# Altium schematic sheet 0_BlkDiag.SchDoc: Block Diagram
size A3; SheetNumber: 0
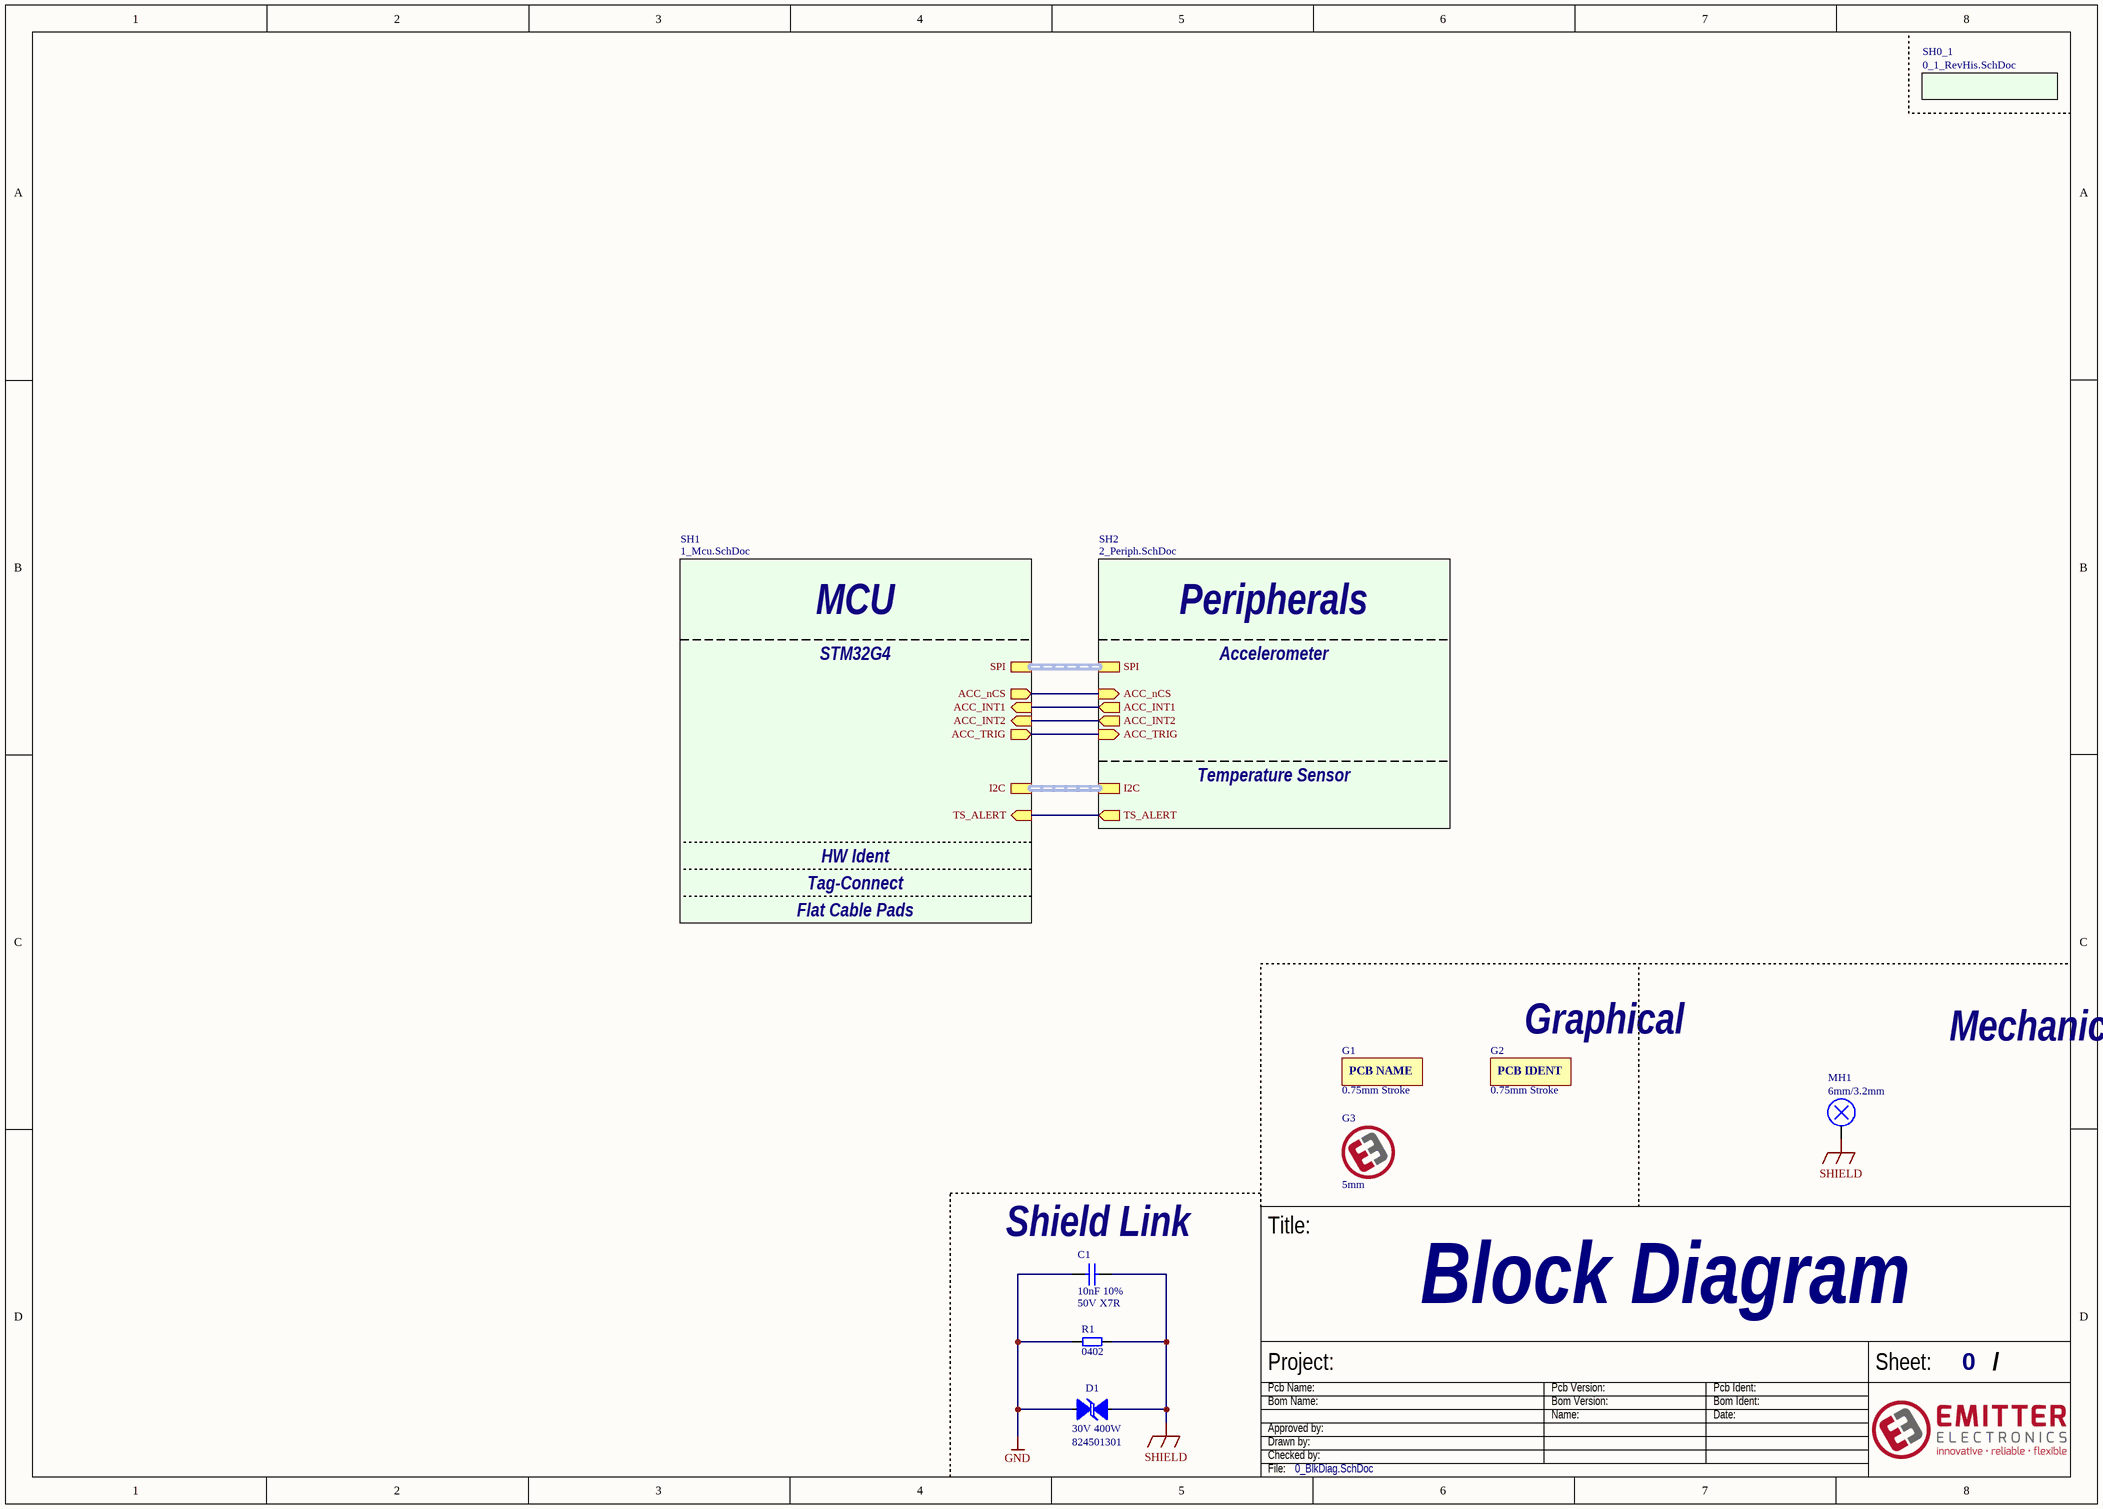
[diagram p0: 0_BlkDiag.SchDoc]

## Parts
C1  Param 1: 10nF 10%  Param 2: 50V X7R  [CAP_0402_L]  (hidden comment: CC0402KRX7R9BB103)
D1  Param 1: 30V 400W  [DIONM510X270_SMA_DO-214AC_L]  (hidden comment: 824501301)
G1  Param 1: 0.75mm Stroke  [GRAPH_PCB_NAME_0.75MM_STROKE]  (hidden comment: /)  (no BOM)
G2  Param 1: 0.75mm Stroke  [GRAPH_PCB_IDENT_0.75MM_STROKE]  (hidden comment: /)  (no BOM)
G3  Param 1: 5mm  [GRAPH_EMITTER_5MM]  (hidden comment: /)  (no BOM)
MH1  Param 1: 6mm/3.2mm  [PS-MH_C600H320]  (hidden comment: /)  (no BOM)
R1  Param 1: 0402  [RES_0402_L]  (hidden comment: RES 0402)

## Sub-sheets
SH0_1 = 0_1_RevHis.SchDoc: no entries
SH1 = 1_Mcu.SchDoc: TS_ALERT (in), ACC_nCS (out), ACC_INT1 (in), ACC_INT2 (in), ACC_TRIG (out), SPI (harness SPI), I2C (harness I2C)
SH2 = 2_Periph.SchDoc: TS_ALERT (out), ACC_nCS (in), ACC_INT2 (out), ACC_INT1 (out), ACC_TRIG (in), SPI (harness SPI), I2C (harness I2C)

## Nets
GND: C1.1 D1.1 R1.1
SHIELD: C1.2 D1.2 MH1.1 R1.2
(unnamed): sheet SH1/TS_ALERT, sheet SH2/TS_ALERT
(unnamed): sheet SH1/ACC_nCS, sheet SH2/ACC_nCS
(unnamed): sheet SH1/ACC_INT1, sheet SH2/ACC_INT1
(unnamed): sheet SH1/ACC_INT2, sheet SH2/ACC_INT2
(unnamed): sheet SH1/ACC_TRIG, sheet SH2/ACC_TRIG

## Buses and harness runs
harness sheet SH1/I2C = sheet SH2/I2C
harness sheet SH1/SPI = sheet SH2/SPI

## Notes on the sheet
- MCU
- STM32G4
- Peripherals
- Accelerometer
- Temperature Sensor
- HW Ident
- Tag-Connect
- Flat Cable Pads
- Graphical
- Mechanical
- (near C1) Shield Link
- Title:
- Project:
- Pcb Name:
- Pcb Version:
- Pcb Ident:
- Sheet:
- /
- Bom Name:
- Drawn by:
- Checked by:
- Approved by:
- Bom Version:
- Name:
- Bom Ident:
- Date:
- File:
- (in symbol GRAPH_PCB_IDENT_0.75MM_STROKE) PCB IDENT
- (in symbol GRAPH_PCB_NAME_0.75MM_STROKE) PCB NAME

## Library data of the parts
C1 = CAP_0402_10nF_10%_50V_X7R_CC0402KRX7R9BB103: CAP 0402 10nF 10% 50V X7R; Assembly Service Part Choice: Yes; Mfr 1: YAGEO; zAlternative 1 - Mfr 1: AVX; zAlternative 1 - Mfr No 2: /; zAlternative 2 - Mfr 1: KEMET; zAlternative 2 - Mfr No 1: C0402C103K5RACTU; zAlternative 1 - Mfr No 1: 04025C103KAT2A; Placement: SMD; Temp Max: +125°C; Temp Min: -55°C; Assembly Service Provides Material: Yes; Author: GH; Date: 30.10.2020; sDigikey 1: /; sFarnell 1: /; sMouser 1: /; sDigikey 2: /; sFarnell 2: /; sMouser 2: /; Mfr No 1: CC0402KRX7R9BB103; Mfr No 2: /; zAlternative 2 - Mfr No 2: /; zAlternative 3 - Mfr 1: /; zAlternative 3 - Mfr No 1: /; zAlternative 3 - Mfr No 2: /; zAlternative 4 - Mfr 1: /; zAlternative 4 - Mfr No 1: /; zAlternative 4 - Mfr No 2: /; zAlternative 5 - Mfr 1: /; zAlternative 5 - Mfr No 1: /; zAlternative 5 - Mfr No 2: /; zAlternative 6 - Mfr 1: /; zAlternative 6 - Mfr No 1: /; zAlternative 6 - Mfr No 2: /; zAlternative 7 - Mfr 1: /; zAlternative 7 - Mfr No 1: /; zAlternative 7 - Mfr No 2: /; zAlternative 8 - Mfr 1: /; zAlternative 8 - Mfr No 1: /; zAlternative 8 - Mfr No 2: /; zAlternative 9 - Mfr 1: /; zAlternative 9 - Mfr No 1: /; zAlternative 9 - Mfr No 2: /; Auralix WH: /; Mfr 2: /; zAlternative 1 - Mfr 2: /; zAlternative 2 - Mfr 2: /; zAlternative 3 - Mfr 2: /; zAlternative 4 - Mfr 2: /; zAlternative 5 - Mfr 2: /; zAlternative 6 - Mfr 2: /; zAlternative 7 - Mfr 2: /; zAlternative 8 - Mfr 2: /; zAlternative 9 - Mfr 2: /; Mfr 3: /; Mfr No 3: /; sArrow 1: /; sArrow 2: /; sArrow 3: /; sDigikey 3: /; sFarnell 3: /; sMouser 3: /
D1 = D-TVS-B_30V_400W_824501301: 824501301 - TVS Diode, WE-TVSP Series, Bidirectional, 30 V, 48.4 V, DO-214AC, 2 Pins; Assembly Service Part Choice: No; Mfr 1: WURTH ELECTRONICS; Placement: SMD; Assembly Service Provides Material: Yes; Param 2: /; Temp Max: +150°C; Temp Min: -65°C; Author: TV; Date: 7.7.2018; sDigikey 1: Yes; sFarnell 1: Yes; sMouser 1: Yes; sDigikey 2: /; sFarnell 2: /; sMouser 2: /; Mfr No 2: /; zAlternative 1 - Mfr 1: /; zAlternative 1 - Mfr No 2: /; zAlternative 2 - Mfr 1: /; zAlternative 2 - Mfr No 1: /; zAlternative 1 - Mfr No 1: /; zAlternative 2 - Mfr No 2: /; zAlternative 3 - Mfr 1: /; zAlternative 3 - Mfr No 1: /; zAlternative 3 - Mfr No 2: /; zAlternative 4 - Mfr 1: /; zAlternative 4 - Mfr No 1: /; zAlternative 4 - Mfr No 2: /; zAlternative 5 - Mfr 1: /; zAlternative 5 - Mfr No 1: /; zAlternative 5 - Mfr No 2: /; zAlternative 6 - Mfr 1: /; zAlternative 6 - Mfr No 1: /; zAlternative 6 - Mfr No 2: /; zAlternative 7 - Mfr 1: /; zAlternative 7 - Mfr No 1: /; zAlternative 7 - Mfr No 2: /; zAlternative 8 - Mfr 1: /; zAlternative 8 - Mfr No 1: /; zAlternative 8 - Mfr No 2: /; zAlternative 9 - Mfr 1: /; zAlternative 9 - Mfr No 1: /; zAlternative 9 - Mfr No 2: /; Auralix WH: /; Mfr 2: /; zAlternative 1 - Mfr 2: /; zAlternative 2 - Mfr 2: /; zAlternative 3 - Mfr 2: /; zAlternative 4 - Mfr 2: /; zAlternative 5 - Mfr 2: /; zAlternative 6 - Mfr 2: /; zAlternative 7 - Mfr 2: /; zAlternative 8 - Mfr 2: /; zAlternative 9 - Mfr 2: /; Mfr 3: /; Mfr No 3: /; sArrow 1: /; sArrow 2: /; sArrow 3: /; sDigikey 3: /; sFarnell 3: /; sMouser 3: /; Mfr No 1: 824501301
G1 = GRAPH_PCB_NAME_0.75MM_STROKE: Placement: /; Assembly Service Part Choice: /; Temp max: /; Temp min: /; Assembly Service Provides Material: /; Author: TV; Date: 16.4.2019; sFarnell 1: /; sDigikey 1: /; sMouser 1: /; sDigikey 2: /; sFarnell 2: /; sMouser 2: /; Mfr No 1: /; Mfr No 2: /; Param 2: /; zAlternative 1 - Mfr No 2: /; zAlternative 2 - Mfr No 1: /; zAlternative 1 - Mfr No 1: /; zAlternative 2 - Mfr No 2: /; zAlternative 3 - Mfr No 1: /; zAlternative 3 - Mfr No 2: /; zAlternative 4 - Mfr No 1: /; zAlternative 4 - Mfr No 2: /; zAlternative 5 - Mfr No 1: /; zAlternative 5 - Mfr No 2: /; zAlternative 6 - Mfr No 1: /; zAlternative 6 - Mfr No 2: /; zAlternative 7 - Mfr No 1: /; zAlternative 7 - Mfr No 2: /; zAlternative 8 - Mfr No 1: /; zAlternative 8 - Mfr No 2: /; zAlternative 9 - Mfr No 1: /; zAlternative 9 - Mfr No 2: /; Auralix WH: /; Mfr 1: /; Mfr 2: /; Mfr 3: /; Mfr No 3: /; sArrow 1: /; sArrow 2: /; sArrow 3: /; sDigikey 3: /; sFarnell 3: /; sMouser 3: /; zAlternative 1 - Mfr 1: /; zAlternative 1 - Mfr 2: /; zAlternative 2 - Mfr 1: /; zAlternative 2 - Mfr 2: /; zAlternative 3 - Mfr 1: /; zAlternative 3 - Mfr 2: /; zAlternative 4 - Mfr 1: /; zAlternative 4 - Mfr 2: /; zAlternative 5 - Mfr 1: /; zAlternative 5 - Mfr 2: /; zAlternative 6 - Mfr 1: /; zAlternative 6 - Mfr 2: /; zAlternative 7 - Mfr 1: /; zAlternative 7 - Mfr 2: /; zAlternative 8 - Mfr 1: /; zAlternative 8 - Mfr 2: /; zAlternative 9 - Mfr 1: /; zAlternative 9 - Mfr 2: /
G2 = GRAPH_PCB_IDENT_0.75MM_STROKE: Placement: /; Assembly Service Part Choice: /; Temp max: /; Temp min: /; Author: TV; Date: 16.4.2019; Assembly Service Provides Material: /; sFarnell 1: /; sDigikey 1: /; sMouser 1: /; sDigikey 2: /; sFarnell 2: /; sMouser 2: /; Mfr No 1: /; Mfr No 2: /; Param 2: /; zAlternative 1 - Mfr No 2: /; zAlternative 2 - Mfr No 1: /; zAlternative 1 - Mfr No 1: /; zAlternative 2 - Mfr No 2: /; zAlternative 3 - Mfr No 1: /; zAlternative 3 - Mfr No 2: /; zAlternative 4 - Mfr No 1: /; zAlternative 4 - Mfr No 2: /; zAlternative 5 - Mfr No 1: /; zAlternative 5 - Mfr No 2: /; zAlternative 6 - Mfr No 1: /; zAlternative 6 - Mfr No 2: /; zAlternative 7 - Mfr No 1: /; zAlternative 7 - Mfr No 2: /; zAlternative 8 - Mfr No 1: /; zAlternative 8 - Mfr No 2: /; zAlternative 9 - Mfr No 1: /; zAlternative 9 - Mfr No 2: /; Auralix WH: /; Mfr 1: /; Mfr 2: /; Mfr 3: /; Mfr No 3: /; zAlternative 1 - Mfr 1: /; zAlternative 1 - Mfr 2: /; zAlternative 2 - Mfr 1: /; zAlternative 2 - Mfr 2: /; zAlternative 3 - Mfr 1: /; zAlternative 3 - Mfr 2: /; zAlternative 4 - Mfr 1: /; zAlternative 4 - Mfr 2: /; zAlternative 5 - Mfr 1: /; zAlternative 5 - Mfr 2: /; zAlternative 6 - Mfr 1: /; zAlternative 6 - Mfr 2: /; zAlternative 7 - Mfr 1: /; zAlternative 7 - Mfr 2: /; zAlternative 8 - Mfr 1: /; zAlternative 8 - Mfr 2: /; zAlternative 9 - Mfr 1: /; zAlternative 9 - Mfr 2: /; sArrow 1: /; sArrow 2: /; sArrow 3: /; sDigikey 3: /; sFarnell 3: /; sMouser 3: /
G3 = GRAPH_EMITTER_5MM: Placement: /; Assembly Service Part Choice: /; Temp max: /; Temp min: /; Author: JK; Date: 18.4.2019; Assembly Service Provides Material: /; sFarnell 1: /; sDigikey 1: /; sMouser 1: /; sDigikey 2: /; sFarnell 2: /; sMouser 2: /; Mfr No 1: /; Mfr No 2: /; Param 2: /; zAlternative 1 - Mfr No 2: /; zAlternative 2 - Mfr No 1: /; zAlternative 1 - Mfr No 1: /; zAlternative 2 - Mfr No 2: /; zAlternative 3 - Mfr No 1: /; zAlternative 3 - Mfr No 2: /; zAlternative 4 - Mfr No 1: /; zAlternative 4 - Mfr No 2: /; zAlternative 5 - Mfr No 1: /; zAlternative 5 - Mfr No 2: /; zAlternative 6 - Mfr No 1: /; zAlternative 6 - Mfr No 2: /; zAlternative 7 - Mfr No 1: /; zAlternative 7 - Mfr No 2: /; zAlternative 8 - Mfr No 1: /; zAlternative 8 - Mfr No 2: /; zAlternative 9 - Mfr No 1: /; zAlternative 9 - Mfr No 2: /; Auralix WH: /; Mfr 1: /; Mfr 2: /; Mfr 3: /; Mfr No 3: /; zAlternative 1 - Mfr 1: /; zAlternative 1 - Mfr 2: /; zAlternative 2 - Mfr 1: /; zAlternative 2 - Mfr 2: /; zAlternative 3 - Mfr 1: /; zAlternative 3 - Mfr 2: /; zAlternative 4 - Mfr 1: /; zAlternative 4 - Mfr 2: /; zAlternative 5 - Mfr 1: /; zAlternative 5 - Mfr 2: /; zAlternative 6 - Mfr 1: /; zAlternative 6 - Mfr 2: /; zAlternative 7 - Mfr 1: /; zAlternative 7 - Mfr 2: /; zAlternative 8 - Mfr 1: /; zAlternative 8 - Mfr 2: /; zAlternative 9 - Mfr 1: /; zAlternative 9 - Mfr 2: /; sArrow 1: /; sArrow 2: /; sArrow 3: /; sDigikey 3: /; sFarnell 3: /; sMouser 3: /
MH1 = PS-MH_C600H320: Mounting Hole - 6mm/3.2mm; Placement: /; Assembly Service Part Choice: /; Temp min: /; Temp max: /; sDigikey 1: /; Author: GH; Date: 19.03.2021; Assembly Service Provides Material: /; sFarnell 1: /; sMouser 1: /; sDigikey 2: /; sFarnell 2: /; sMouser 2: /; Param 2: /; Mfr No 1: /; Mfr No 2: /; zAlternative 1 - Mfr No 2: /; zAlternative 2 - Mfr No 1: /; zAlternative 1 - Mfr No 1: /; zAlternative 2 - Mfr No 2: /; zAlternative 3 - Mfr No 1: /; zAlternative 3 - Mfr No 2: /; zAlternative 4 - Mfr No 1: /; zAlternative 4 - Mfr No 2: /; zAlternative 5 - Mfr No 1: /; zAlternative 5 - Mfr No 2: /; zAlternative 6 - Mfr No 1: /; zAlternative 6 - Mfr No 2: /; zAlternative 7 - Mfr No 1: /; zAlternative 7 - Mfr No 2: /; zAlternative 8 - Mfr No 1: /; zAlternative 8 - Mfr No 2: /; zAlternative 9 - Mfr No 1: /; zAlternative 9 - Mfr No 2: /; Auralix WH: /; Mfr 1: /; Mfr 2: /; Mfr 3: /; Mfr No 3: /; zAlternative 1 - Mfr 1: /; zAlternative 1 - Mfr 2: /; zAlternative 2 - Mfr 1: /; zAlternative 2 - Mfr 2: /; zAlternative 3 - Mfr 1: /; zAlternative 3 - Mfr 2: /; zAlternative 4 - Mfr 1: /; zAlternative 4 - Mfr 2: /; zAlternative 5 - Mfr 1: /; zAlternative 5 - Mfr 2: /; zAlternative 6 - Mfr 1: /; zAlternative 6 - Mfr 2: /; zAlternative 7 - Mfr 1: /; zAlternative 7 - Mfr 2: /; zAlternative 8 - Mfr 1: /; zAlternative 8 - Mfr 2: /; zAlternative 9 - Mfr 1: /; zAlternative 9 - Mfr 2: /; sArrow 1: /; sArrow 2: /; sArrow 3: /; sDigikey 3: /; sFarnell 3: /; sMouser 3: /
R1 = RES_0402: Assembly Service Part Choice: /; Placement: SMD; Temp Max: /; Temp Min: /; Assembly Service Provides Material: /; Mfr 1: /; Author: TV; Date: 14.12.2019; sDigikey 1: /; sFarnell 1: /; sMouser 1: /; sDigikey 2: /; sFarnell 2: /; sMouser 2: /; Mfr No 1: RES 0402; Mfr No 2: /; zAlternative 1 - Mfr 1: /; zAlternative 1 - Mfr No 2: /; zAlternative 2 - Mfr 1: /; zAlternative 2 - Mfr No 1: /; zAlternative 1 - Mfr No 1: /; zAlternative 2 - Mfr No 2: /; zAlternative 3 - Mfr 1: /; zAlternative 3 - Mfr No 1: /; zAlternative 3 - Mfr No 2: /; zAlternative 4 - Mfr 1: /; zAlternative 4 - Mfr No 1: /; zAlternative 4 - Mfr No 2: /; zAlternative 5 - Mfr 1: /; zAlternative 5 - Mfr No 1: /; zAlternative 5 - Mfr No 2: /; zAlternative 6 - Mfr 1: /; zAlternative 6 - Mfr No 1: /; zAlternative 6 - Mfr No 2: /; zAlternative 7 - Mfr 1: /; zAlternative 7 - Mfr No 1: /; zAlternative 7 - Mfr No 2: /; zAlternative 8 - Mfr 1: /; zAlternative 8 - Mfr No 1: /; zAlternative 8 - Mfr No 2: /; zAlternative 9 - Mfr 1: /; zAlternative 9 - Mfr No 1: /; zAlternative 9 - Mfr No 2: /; Auralix WH: /; Param 2: /; Mfr 2: /; zAlternative 1 - Mfr 2: /; zAlternative 2 - Mfr 2: /; zAlternative 3 - Mfr 2: /; zAlternative 4 - Mfr 2: /; zAlternative 5 - Mfr 2: /; zAlternative 6 - Mfr 2: /; zAlternative 7 - Mfr 2: /; zAlternative 8 - Mfr 2: /; zAlternative 9 - Mfr 2: /; Mfr 3: /; Mfr No 3: /; sArrow 1: /; sArrow 2: /; sArrow 3: /; sDigikey 3: /; sFarnell 3: /; sMouser 3: /